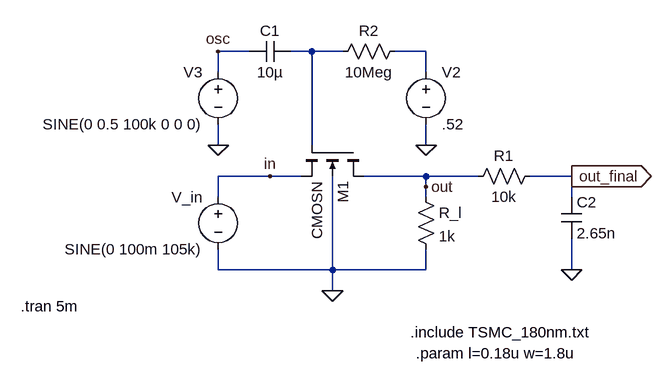
[diagram p0: schematic Mixer w Low Pass.asc]
Mixer w Low Pass.asc, the LTspice schematic file:
Version 4.1
SHEET 1 880 680
WIRE 80 64 32 64
WIRE 176 64 144 64
WIRE 224 64 176 64
WIRE 352 64 304 64
WIRE 32 96 32 64
WIRE 352 96 352 64
WIRE 32 208 32 176
WIRE 176 208 176 64
WIRE 352 208 352 176
WIRE 112 256 32 256
WIRE 160 256 112 256
WIRE 352 256 256 256
WIRE 432 256 352 256
WIRE 576 256 512 256
WIRE 352 272 352 256
WIRE 32 288 32 256
WIRE 352 288 352 272
WIRE 576 288 576 256
WIRE 32 400 32 368
WIRE 208 400 208 256
WIRE 208 400 32 400
WIRE 352 400 352 368
WIRE 352 400 208 400
WIRE 576 400 576 352
WIRE 208 432 208 400
FLAG 208 432 0
FLAG 352 208 0
FLAG 32 208 0
FLAG 112 256 in
FLAG 352 272 out
FLAG 32 64 osc
FLAG 576 400 0
FLAG 576 256 out_final
IOPIN 576 256 Out
SYMBOL nmos4 256 208 R90
SYMATTR InstName M1
SYMATTR Value CMOSN
SYMATTR Value2 l=l w=w ad=2.5*l*w as=2.5*l*w pd=5*l+2*w ps=5*l+2*w
SYMBOL res 336 272 R0
SYMATTR InstName R_l
SYMATTR Value 1k
SYMBOL res 320 48 R90
WINDOW 0 0 56 VBottom 2
WINDOW 3 32 56 VTop 2
SYMATTR InstName R2
SYMATTR Value 10Meg
SYMBOL voltage 352 80 R0
WINDOW 123 0 0 Left 0
WINDOW 39 0 0 Left 0
SYMATTR InstName V2
SYMATTR Value .52
SYMBOL cap 144 48 R90
WINDOW 0 0 32 VBottom 2
WINDOW 3 32 32 VTop 2
SYMATTR InstName C1
SYMATTR Value 10µ
SYMBOL voltage 32 80 M0
WINDOW 123 0 0 Left 0
WINDOW 39 0 0 Left 0
SYMATTR InstName V3
SYMATTR Value SINE(0 0.5 100k 0 0 0)
SYMBOL voltage 32 272 M0
WINDOW 123 0 0 Left 0
WINDOW 39 0 0 Left 0
SYMATTR InstName V_in
SYMATTR Value SINE(0 100m 105k)
SYMBOL res 528 240 R90
WINDOW 0 0 56 VBottom 2
WINDOW 3 32 56 VTop 2
SYMATTR InstName R1
SYMATTR Value 10k
SYMBOL cap 560 288 R0
SYMATTR InstName C2
SYMATTR Value 2.65n
TEXT -272 456 Left 2 !.tran 5m
TEXT 328 496 Left 2 !.include TSMC_180nm.txt
TEXT 336 528 Left 2 !.param l=0.18u w=1.8u

The netlist it stands for:
* Mixer w Low Pass.asc
M1 out N001 in 0 CMOSN l=l w=w ad=2.5*l*w as=2.5*l*w pd=5*l+2*w ps=5*l+2*w
R_l out 0 1k
R2 N002 N001 10Meg
V2 N002 0 .52
C1 N001 osc 10µ
V3 osc 0 SINE(0 0.5 100k 0 0 0)
V_in in 0 SINE(0 100m 105k)
R1 out_final out 10k
C2 out_final 0 2.65n
.model NMOS NMOS
.model PMOS PMOS
.lib standard.mos
.tran 5m
.include TSMC_180nm.txt
.param l=0.18u w=1.8u
.backanno
.end